# Altium schematic sheet 04 - MIPI INTERFACE.SchDoc
size 420 x 297 mm
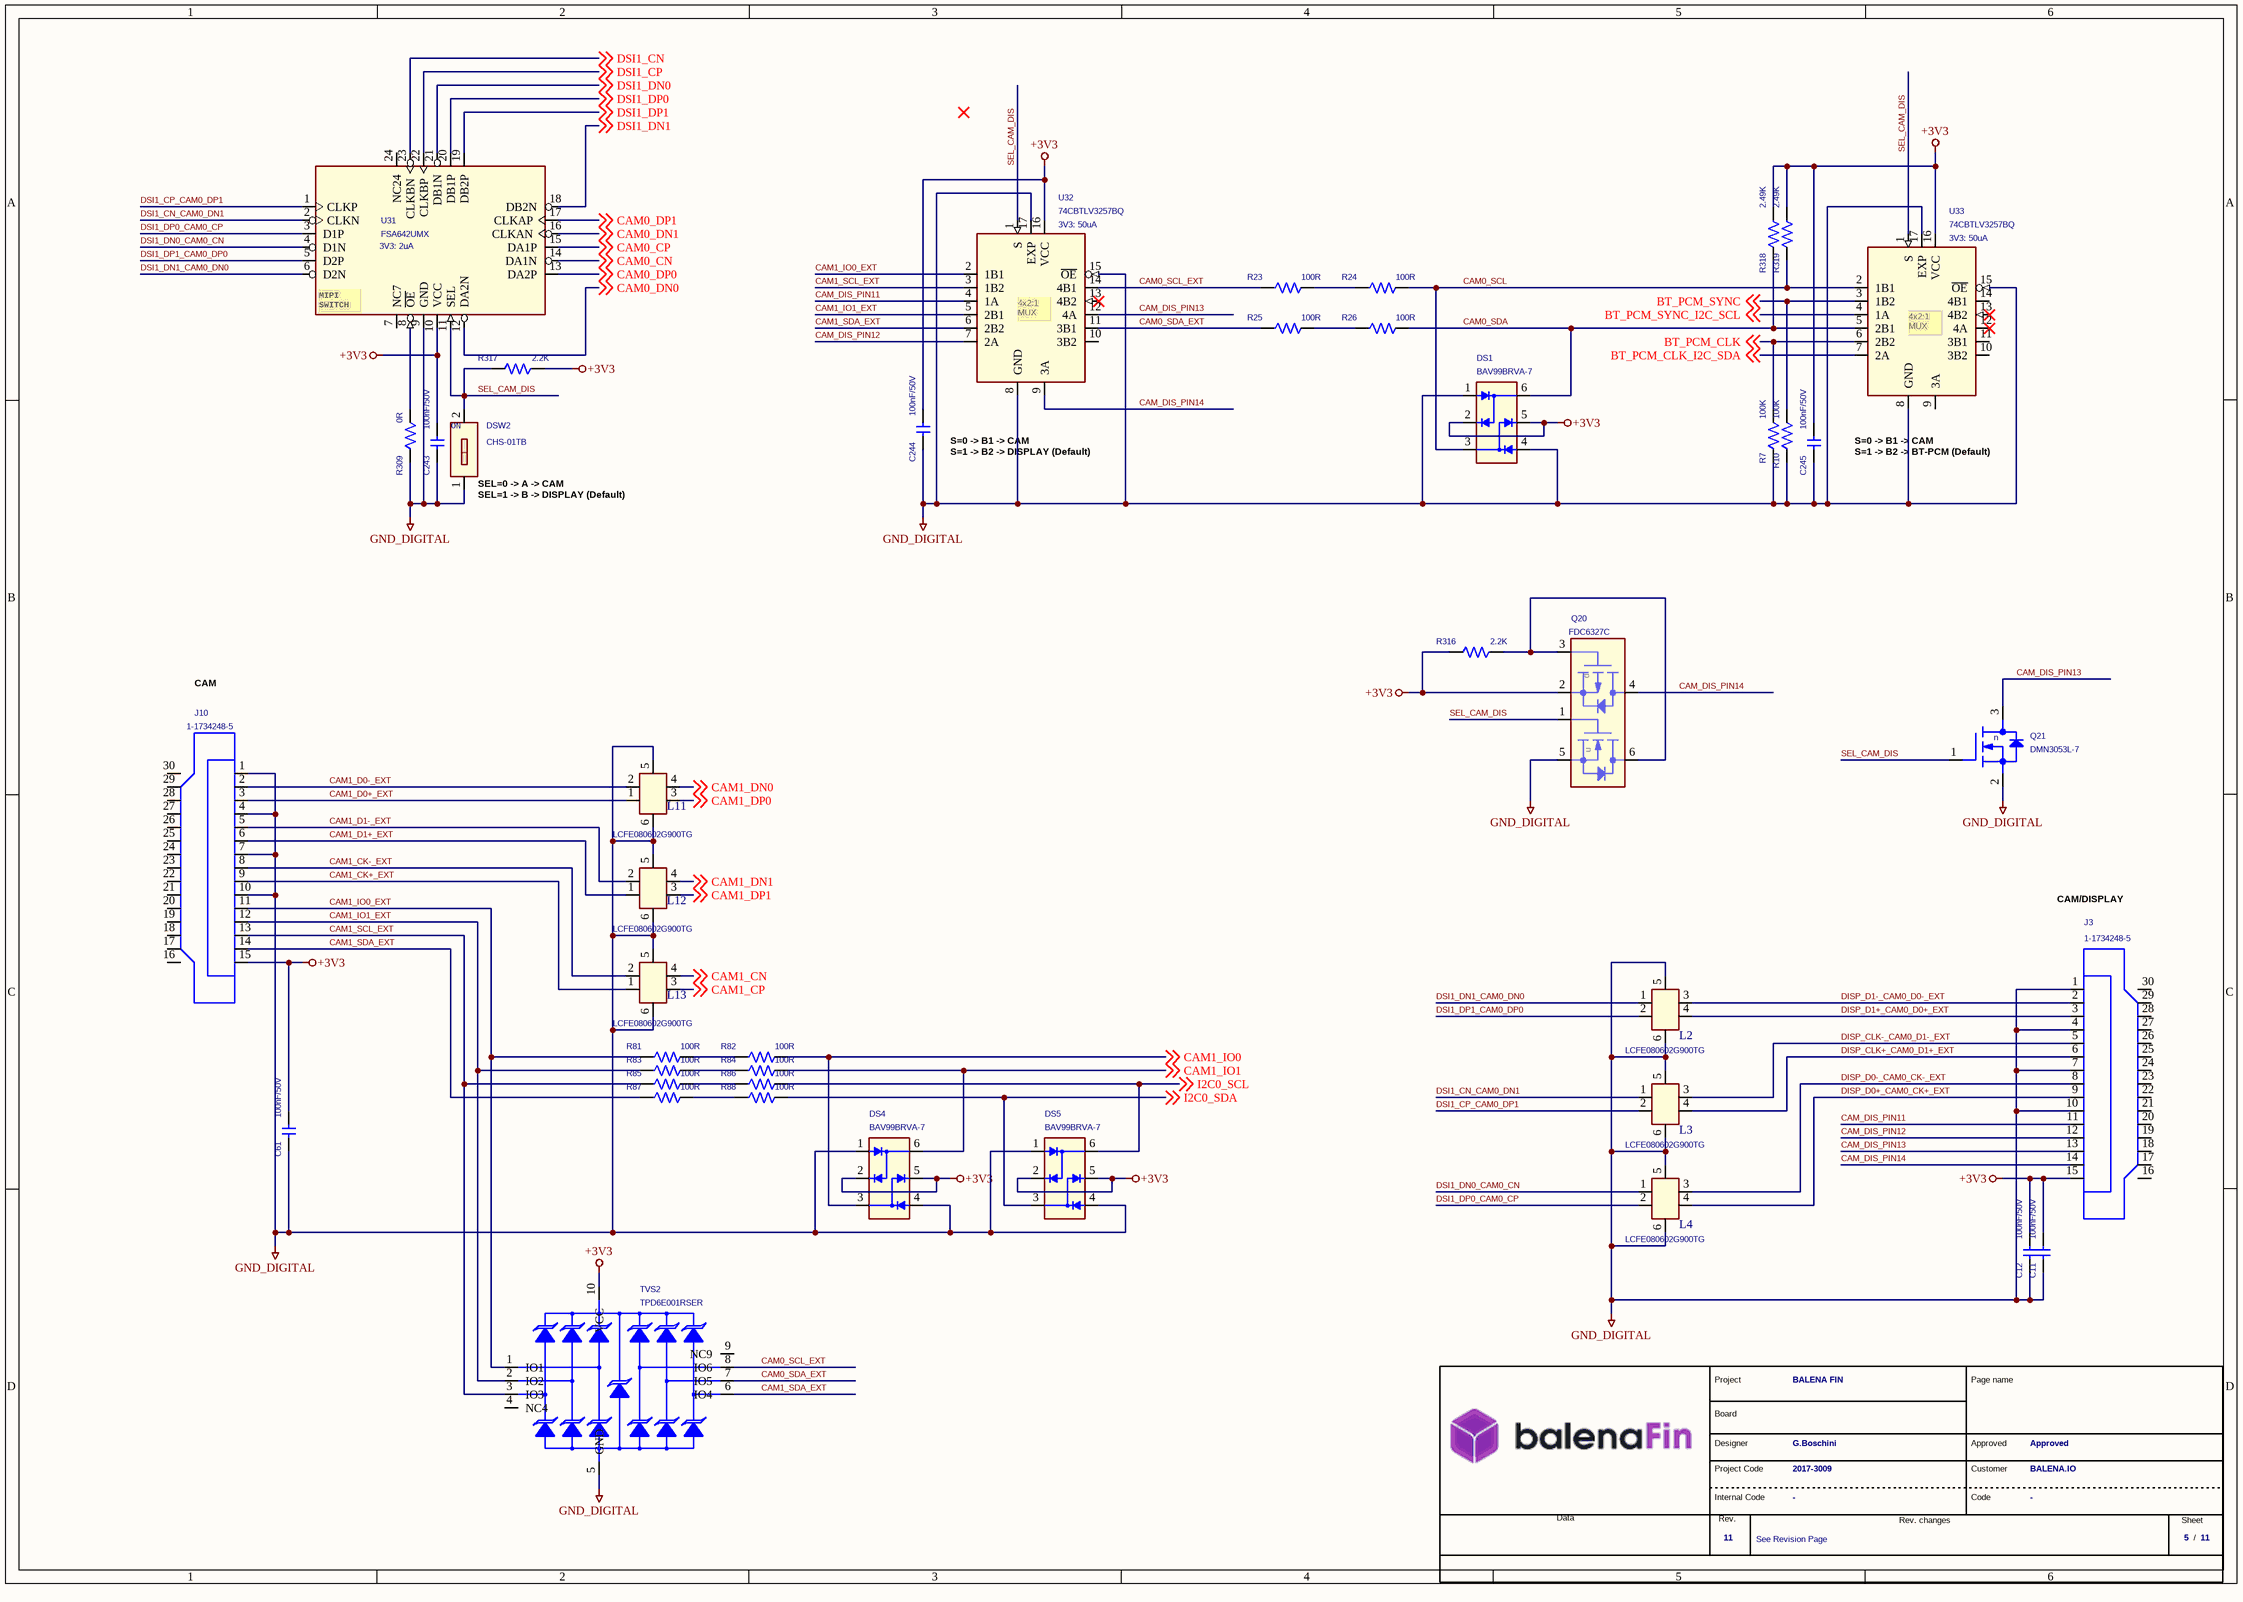
[diagram p0: 04 - MIPI INTERFACE.SchDoc]

## Parts
*  Revision: 11  FAE RD code: 2017-3009  DocumentoRev: See Revision Page  Page Number: 5  Nome Progetto: BALENA FIN  Customer name: BALENA.IO  Project manager: Approved  Project designer: G.Boschini  (hidden comment: MyFAEVuoto)  (graphical)
C11  100nF/50V  [CS-C-0402]
C12  100nF/50V  [CS-C-0402]
C61  100nF/50V  [CS-C-0402]
C243  100nF/50V  [CS-C-0402]
C244  100nF/50V  [CS-C-0402]
C245  100nF/50V  [CS-C-0402]
DS1  BAV99BRVA-7  [SOT563]
DS4  BAV99BRVA-7  [SOT563]
DS5  BAV99BRVA-7  [SOT563]
DSW2  CHS-01TB  [DSS-CHS-01TB]
J3  1-1734248-5  [J-15X2-0100-FDS-ZIF]
J10  1-1734248-5  [J-15X2-0100-FDS-ZIF]
L2  LCFE080602G900TG  [LCFE080602G900TG]
L3  LCFE080602G900TG  [LCFE080602G900TG]
L4  LCFE080602G900TG  [LCFE080602G900TG]
L11  LCFE080602G900TG  [LCFE080602G900TG]
L12  LCFE080602G900TG  [LCFE080602G900TG]
L13  LCFE080602G900TG  [LCFE080602G900TG]
Q20  FDC6327C  [SOT23-6-DBV]
Q21  DMN3053L-7  [SOT23]
R7  100K  [RS-0402]
R10  100K  [RS-0402]
R23  100R  [RS-0402]
R24  100R  [RS-0402]
R25  100R  [RS-0402]
R26  100R  [RS-0402]
R81  100R  [RS-0402]
R82  100R  [RS-0402]
R83  100R  [RS-0402]
R84  100R  [RS-0402]
R85  100R  [RS-0402]
R86  100R  [RS-0402]
R87  100R  [RS-0402]
R88  100R  [RS-0402]
R309  0R  [RS-0402]
R316  2.2K  [RS-0402]
R317  2.2K  [RS-0402]
R318  2.49K  [RS-0402]
R319  2.49K  [RS-0402]
TVS2  TPD6E001RSER  [UFQFN10]
U31  FSA642UMX  Power requirements: 3V3: 2uA  [UFQFN24-0250X0340]
U32  74CBTLV3257BQ  Power requirements: 3V3: 50uA  [VFQFN16-EXP-0250X0300]
U33  74CBTLV3257BQ  Power requirements: 3V3: 50uA  [VFQFN16-EXP-0250X0300]

## Nets
+3V3: C11.1 C12.1 C61.1 C243.1 C244.1 C245.1 DS1.2(C1) DS1.5(C2) DS4.2(C1) DS4.5(C2) DS5.2(C1) DS5.5(C2) J3.15 J10.15 Q20.2(S1) R316.2 R317.1 R318.1 R319.1 TVS2.10(VCC) U31.10(VCC) U32.16(VCC) U33.16(VCC)
GND_DIGITAL: C11.2 C12.2 C61.2 C243.2 C244.2 C245.2 DS1.1(A1) DS1.4(A2) DS4.1(A1) DS4.4(A2) DS5.1(A1) DS5.4(A2) DSW2.1 J3.1 J3.4 J3.7 J3.10 J10.1 J10.4 J10.7 J10.10 L2.5 L2.6 L3.5 L3.6 L4.5 L4.6 L11.5 L11.6 L12.5 L12.6 L13.5 L13.6 Q20.5(S2) Q21.2(S) R7.1 R10.1 R309.1 TVS2.5(GND) U31.9(GND) U32.8(GND) U32.15(~{OE}) U32.17(EXP) U33.8(GND) U33.15(~{OE}) U33.17(EXP)
BT_PCM_CLK: R7.2 U33.6(2B2) ; off-sheet BT_PCM_CLK
BT_PCM_CLK_I2C_SDA: U33.7(2A) ; off-sheet BT_PCM_CLK_I2C_SDA
BT_PCM_SYNC: R10.2 U33.3(1B2) ; off-sheet BT_PCM_SYNC
BT_PCM_SYNC_I2C_SCL: U33.4(1A) ; off-sheet BT_PCM_SYNC_I2C_SCL
CAM0_CN: U31.14(DA1N) ; off-sheet CAM0_CN
CAM0_CP: U31.15(DA1P) ; off-sheet CAM0_CP
CAM0_DN0: U31.12(DA2N) ; off-sheet CAM0_DN0
CAM0_DN1: U31.16(CLKAN) ; off-sheet CAM0_DN1
CAM0_DP0: U31.13(DA2P) ; off-sheet CAM0_DP0
CAM0_DP1: U31.17(CLKAP) ; off-sheet CAM0_DP1
CAM0_SCL: DS1.3(AC2) R24.2 R319.2 U33.2(1B1)
CAM0_SCL_EXT: R23.1 TVS2.8(IO6) U32.14(4B1)
CAM0_SDA: DS1.6(AC1) R26.2 R318.2 U33.5(2B1)
CAM0_SDA_EXT: R25.1 TVS2.7(IO5) U32.11(3B1)
CAM1_CK+_EXT: J10.9 L13.1
CAM1_CK-_EXT: J10.8 L13.2
CAM1_CN: L13.4 ; off-sheet CAM1_CN
CAM1_CP: L13.3 ; off-sheet CAM1_CP
CAM1_D0+_EXT: J10.3 L11.1
CAM1_D0-_EXT: J10.2 L11.2
CAM1_D1+_EXT: J10.6 L12.1
CAM1_D1-_EXT: J10.5 L12.2
CAM1_DN0: L11.4 ; off-sheet CAM1_DN0
CAM1_DN1: L12.4 ; off-sheet CAM1_DN1
CAM1_DP0: L11.3 ; off-sheet CAM1_DP0
CAM1_DP1: L12.3 ; off-sheet CAM1_DP1
CAM1_IO0: DS4.3(AC2) R82.2 ; off-sheet CAM1_IO0
CAM1_IO0_EXT: J10.11 R81.1 TVS2.1(IO1) U32.2(1B1)
CAM1_IO1: DS4.6(AC1) R84.2 ; off-sheet CAM1_IO1
CAM1_IO1_EXT: J10.12 R83.1 TVS2.2(IO2) U32.5(2B1)
CAM1_SCL_EXT: J10.13 R85.1 TVS2.3(IO3) U32.3(1B2)
CAM1_SDA_EXT: J10.14 R87.1 TVS2.6(IO4) U32.6(2B2)
CAM_DIS_PIN11: J3.11 U32.4(1A)
CAM_DIS_PIN12: J3.12 U32.7(2A)
CAM_DIS_PIN13: J3.13 Q21.3(D) U32.12(4A)
CAM_DIS_PIN14: J3.14 Q20.4(D1) U32.9(3A)
DISP_CLK+_CAM0_D1+_EXT: J3.6 L3.4
DISP_CLK-_CAM0_D1-_EXT: J3.5 L3.3
DISP_D0+_CAM0_CK+_EXT: J3.9 L4.4
DISP_D0-_CAM0_CK-_EXT: J3.8 L4.3
DISP_D1+_CAM0_D0+_EXT: J3.3 L2.4
DISP_D1-_CAM0_D0-_EXT: J3.2 L2.3
DSI1_CN: U31.23(CLKBN) ; off-sheet DSI1_CN
DSI1_CN_CAM0_DN1: L3.1 U31.2(CLKN)
DSI1_CP: U31.22(CLKBP) ; off-sheet DSI1_CP
DSI1_CP_CAM0_DP1: L3.2 U31.1(CLKP)
DSI1_DN0: U31.21(DB1N) ; off-sheet DSI1_DN0
DSI1_DN0_CAM0_CN: L4.1 U31.4(D1N)
DSI1_DN1: U31.18(DB2N) ; off-sheet DSI1_DN1
DSI1_DN1_CAM0_DN0: L2.1 U31.6(D2N)
DSI1_DP0: U31.20(DB1P) ; off-sheet DSI1_DP0
DSI1_DP0_CAM0_CP: L4.2 U31.3(D1P)
DSI1_DP1: U31.19(DB2P) ; off-sheet DSI1_DP1
DSI1_DP1_CAM0_DP0: L2.2 U31.5(D2P)
I2C0_SCL: DS5.6(AC1) R86.2 ; off-sheet I2C0_SCL
I2C0_SDA: DS5.3(AC2) R88.2 ; off-sheet I2C0_SDA
SEL_CAM_DIS: DSW2.2 Q20.1(G2) Q21.1(G) R317.2 U31.11(SEL) U32.1(S) U33.1(S)
NetQ20_3: Q20.3(G1) Q20.6(D2) R316.1
NetR23_2: R23.2 R24.1
NetR25_2: R25.2 R26.1
NetR81_2: R81.2 R82.1
NetR83_2: R83.2 R84.1
NetR85_2: R85.2 R86.1
NetR87_2: R87.2 R88.1
NetR309_2: R309.2 U31.8(~{OE})

Not connected (* = marked no-connect by the designer): J3 16 17 18 19 20 21 22 23 24 25 26 27 28 29 30; J10 16 17 18 19 20 21 22 23 24 25 26 27 28 29 30; TVS2 4(NC4) 9(NC9); U31 7(NC7) 24(NC24); U32 10(3B2) 13(4B2)*; U33 9(3A) 10(3B2) 11(3B1) 12(4A)* 13(4B2)* 14(4B1)

## Notes on the sheet
- (near C244) S=0 -> B1 -> CAM
  S=1 -> B2 -> DISPLAY (Default)
- S=0 -> B1 -> CAM
  S=1 -> B2 -> BT-PCM (Default)
- (near DSW2) SEL=0 -> A -> CAM
  SEL=1 -> B -> DISPLAY (Default)
- CAM
- CAM/DISPLAY
- (in symbol DIP-SW-1x-CHS-01TB-SMD) ON
- (in symbol MIPI-SWITCH - FSA642UMX) MIPI / SWITCH
- (in symbol MUX-AN-4x2-1 - 74CBTLV3257BQ) 4x2:1 / MUX
- (in symbol MyFAEVuoto) Project; Page name; Board; Designer; Project Code; Customer; Internal Code; Code; Data; Rev.; Rev. changes; Sheet; /
- (in symbol N-P MOS-FDC6327C-2.7A/1.9A/20V) p; n
- (in symbol NMOS - DMN3053L-7 - 4A/30V) n

## Library data of the parts
C11 C12 C243-C245 = CS-C-0402-100n/16V: CHIP CAP.CER. 100nF 16V 10% X7R 0402; MPN: Generic; Alternative MPN: C0402C104K4RACTU; Room: DISPLAY DSI; Pkg Type: SMD; Mount: Yes
C61 = CS-C-0402-100n/16V: CHIP CAP.CER. 100nF 16V 10% X7R 0402; MPN: Generic; Alternative MPN: C0402C104K4RACTU; Room: CAMERA CSI; Pkg Type: SMD; Mount: Yes
DS1 = DIODO4x - BAV99BRVA-7 -0.2A/75V: Diode Switching 75V 0.215A 6-Pin SOT-563 T/R; Room: DISPLAY DSI; Note: 2x Serie; Pkg Type: SMD; Temperature range: -65°..+150°; MPN: BAV99BRVA-7; Mount: Yes
DS4 DS5 = DIODO4x - BAV99BRVA-7 -0.2A/75V: Diode Switching 75V 0.215A 6-Pin SOT-563 T/R; Room: CAMERA CSI; Note: 2x Serie; Pkg Type: SMD; Temperature range: -65°..+150°; MPN: BAV99BRVA-7; Mount: Yes
DSW2 = DIP-SW-1x-CHS-01TB-SMD: Dip Switch SPST 1 Position - Surface Mount Slide (Standard) - Actuator 100mA 6VDC; Pkg Type: SMD; Temperature range: -40°..+85°; MPN: CHS-01TB; Mount: Yes
J3 = FPC-ZIF - J-15X2-0100-FDS-ZIF: CONN FPC VERT 15POS 1.00MM SMD; Room: DISPLAY DSI; Temperature range: -20°..+85°; Pkg Type: SMD; MPN: 1-1734248-5; Mount: Yes
J10 = FPC-ZIF - J-15X2-0100-FDS-ZIF: CONN FPC VERT 15POS 1.00MM SMD; Room: CAMERA CSI; Temperature range: -20°..+85°; Pkg Type: SMD; MPN: 1-1734248-5; Mount: Yes
L2-L4 L11-L13 = LCFE080602G900TG: Common Mode Chokes / Filters 90ohms 25% 100A 2 Lines 0806; Note: ESD Protection Inside; Pkg Type: SMD; MPN: LCFE080602G900TG; Mount: Yes
Q20 = N-P MOS-FDC6327C-2.7A/1.9A/20V: MOSFET N/P-CH 20V SSOT-6; Pkg Type: SMD; Temperature range: -55°..+150°; MPN: FDC6327C; Mount: Yes
Q21 = NMOS - DMN3053L-7 - 4A/30V: MOSFET N-CH 30V 4A SOT23; Pkg Type: SMD; Temperature range: -55°..+150°; MPN: DMN3053L-7; Mount: Yes
R7 R10 = RS-0402-100k: CHIP RES. 100K 0402 1/16W 1%; MPN: Generic; Pkg Type: SMD; Room: CM3L; Mount: Yes
R23-R26 = RS-0402-100r: CHIP RES. 100R 0402 1/16W 1%; MPN: Generic; Pkg Type: SMD; Room: DISPLAY DSI; Mount: Yes
R81-R88 = RS-0402-100r: CHIP RES. 100R 0402 1/16W 1%; MPN: Generic; Pkg Type: SMD; Room: CAMERA CSI; Mount: Yes
R309 = RS-0402-0r: CHIP RES. 0R 0402 1/16W 1%; MPN: Generic; Pkg Type: SMD; Mount: Yes
R316 R317 = RS-0402-2.2k: CHIP RES. 2K2 0402 1/16W 1%; MPN: Generic; Pkg Type: SMD; Mount: Yes
R318 R319 = RS-0402-2.49k: CHIP RES. 2K49 0402 1/16W 1% 100PPM/°C; MPN: Generic; Room: CM3L; Note: 100ppm; Pkg Type: SMD; Mount: Yes
TVS2 = TVS-UNI6x - TPD6E001RSER: TVS DIODE 5VWM; Room: CAMERA CSI; Pkg Type: SMD; Note: Unidirectional - 6x - High-Speed Data Interface  I/O; Temperature range: -40°..+85°; MPN: TPD6E001RSER; Mount: Yes
U31 = MIPI-SWITCH - FSA642UMX: IC SWITCH 3PDT 24UMLP; Note: Up to 1GHz; Pkg Type: SMD; Temperature range: -40°..85°; MPN: FSA642UMX; Mount: Yes
U32 U33 = MUX-AN-4x2-1 - 74CBTLV3257BQ: IC MUX/DEMUX 4 X 1:2 16DHVQFN; Pkg Type: SMD; Temperature range: -40°..125°; MPN: 74CBTLV3257BQ; Mount: Yes
* = MyFAEVuoto: Page Count: 11; Customer Code: -; Database: -